# Altium schematic sheet PowerDetection.SchDoc
size A2
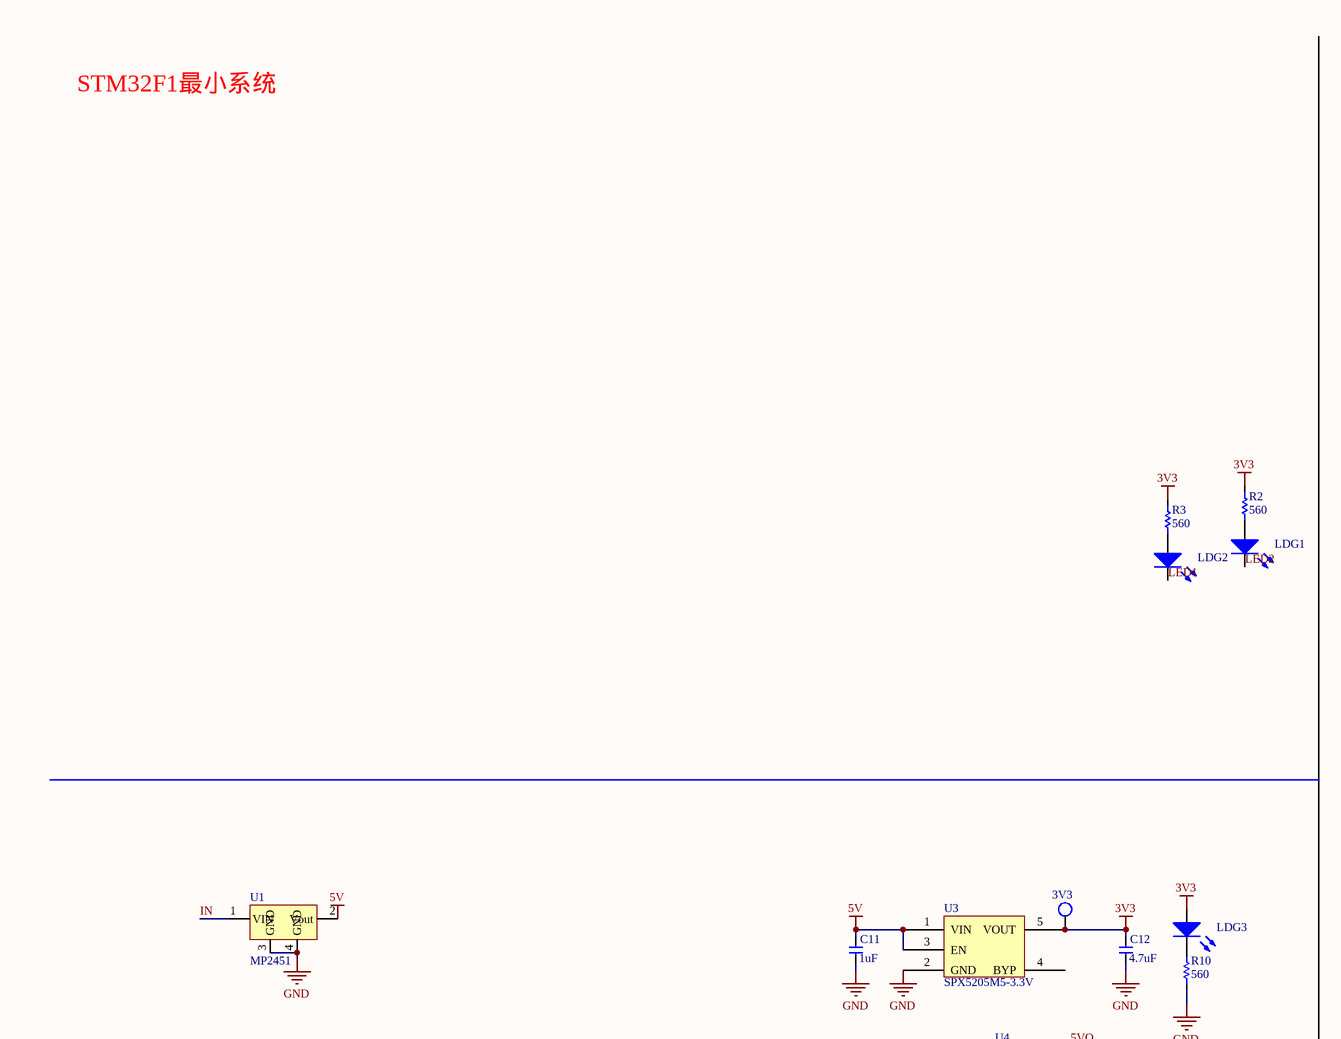
[diagram p0: PowerDetection.SchDoc, top left]
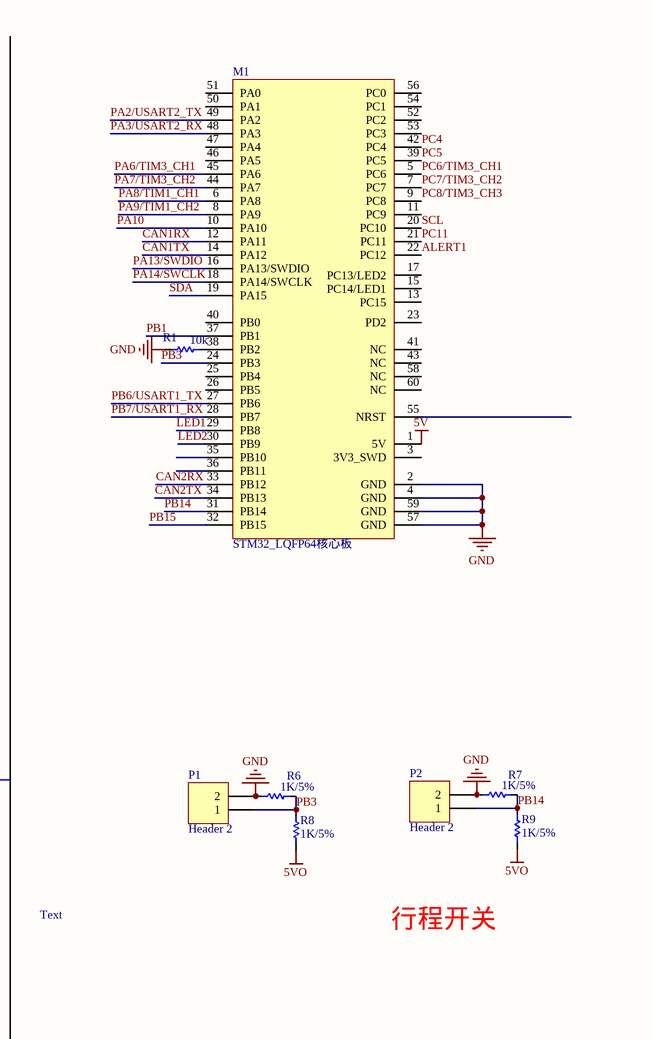
[diagram p1: PowerDetection.SchDoc, top right]
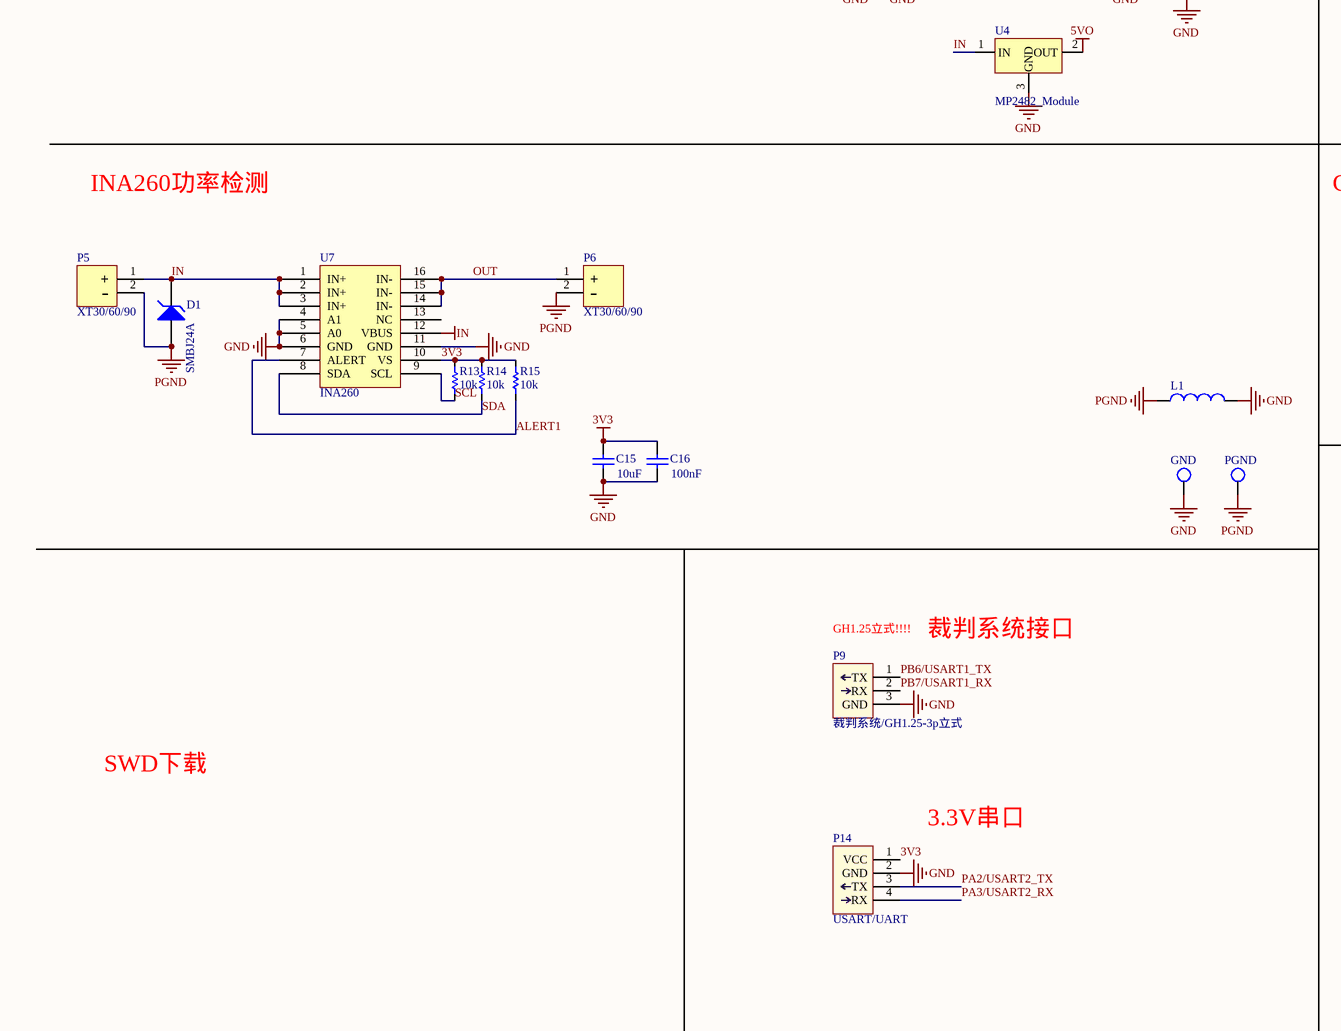
[diagram p2: PowerDetection.SchDoc, bottom left]
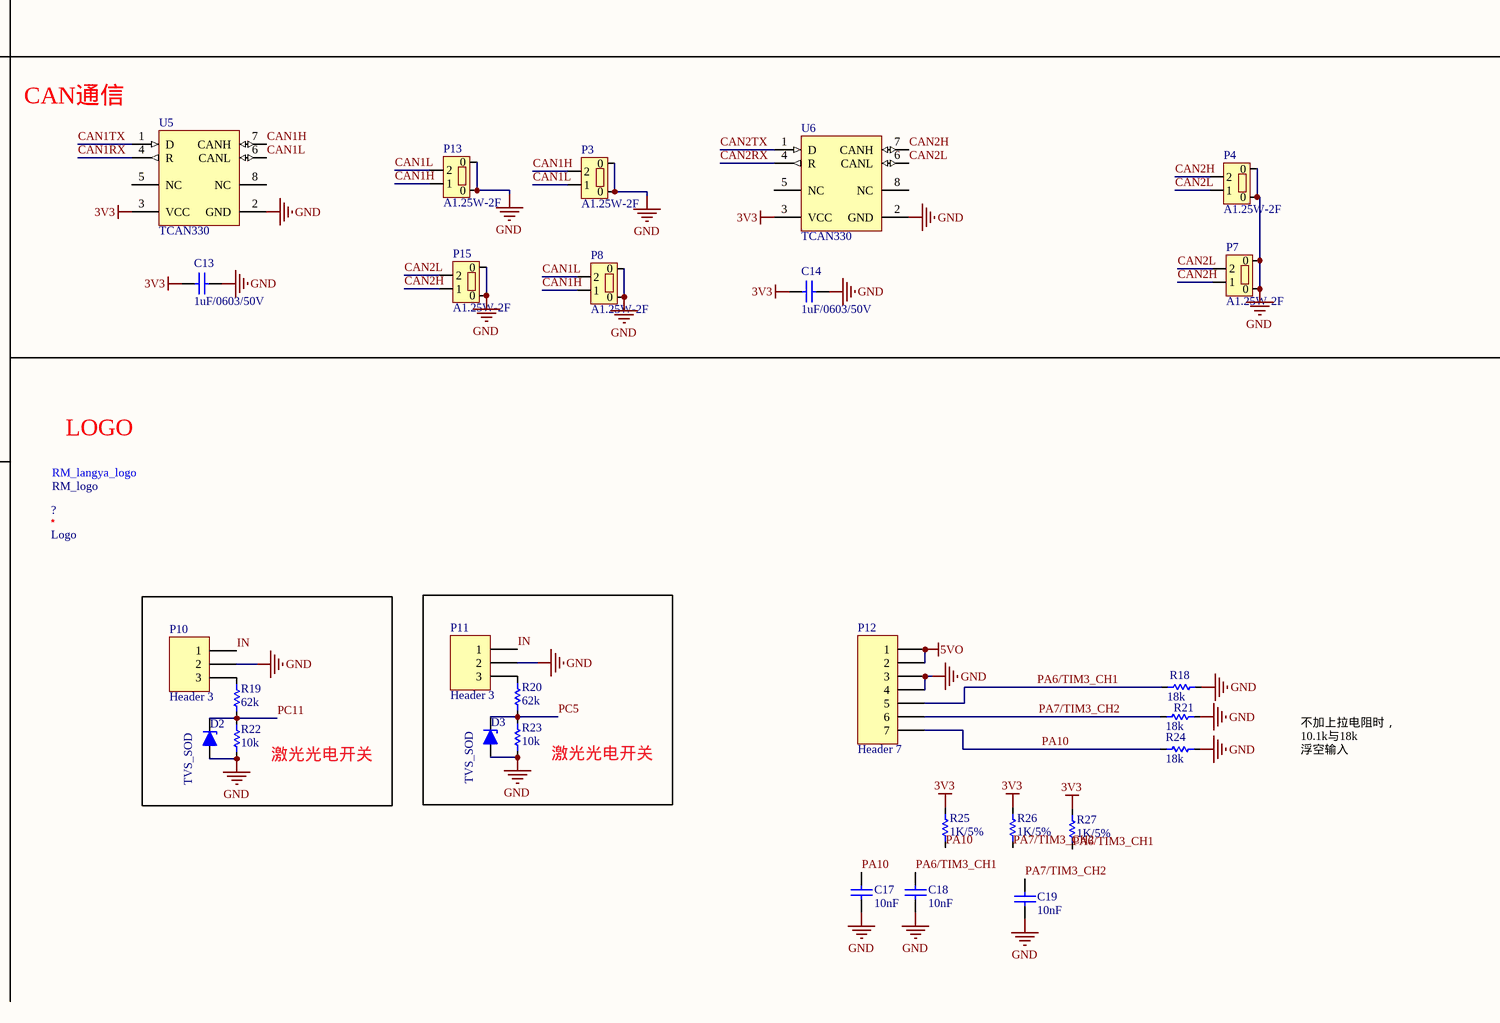
[diagram p3: PowerDetection.SchDoc, bottom right]

## Parts
3V3  3V3  [TP_SMT]  (value not drawn)
?  Logo  [logo_langya - duplicate]
C11  1uF  [0603C]
C12  4.7uF  [0603C]
C13  1uF/0603/50V  [0603C]
C14  1uF/0603/50V  [0603C]
C15  value 10uF  [0603C]  (hidden comment: 100nF)
C16  value 100nF  [0603C]
C17  10nF  [0603C]
C18  10nF  [0603C]
C19  10nF  [0603C]
D1  SMBJ24A  [SMB/DO-214AA]
D2  TVS_SOD  [SOD-323-]
D3  TVS_SOD  [SOD-323-]
GND  PGND  [TP_VIA]  (value not drawn)
L1  10mH/0402  [0603L]  (value not drawn)
LangYa1  RM_logo  [RM_logo 300mil*350]
LDG1  LED_RED  [0603LED_G]  (value not drawn)
LDG2  LED_RED  [0603LED_G]  (value not drawn)
LDG3  LED_RED  [0603LED_G]  (value not drawn)
M1  STM32_LQFP64核心板  [STM32_LQFP64核心板]
P1  Header 2  [HY2.00MM 2X1 SMT]
P2  Header 2  [HY2.00MM 2X1 SMT]
P3  A1.25W-2F  [GH1.25_立式]
P4  A1.25W-2F  [GH1.25_立式]
P5  XT30/60/90  [XT30立式]
P6  XT30/60/90  [XT30立式]
P7  A1.25W-2F  [GH1.25_立式]
P8  A1.25W-2F  [GH1.25_立式]
P9  裁判系统/GH1.25-3p立式  [A1254-03AWB]
P10  Header 3  [HY2.00MM 3X1 SMT]
P11  Header 3  [HY2.00MM 3X1 SMT]
P12  Header 7  [A1.25WF-7P]
P13  A1.25W-2F  [GH1.25-2p-卧贴]
P14  USART/UART  [HY2.00MM 4X1 SMT]
P15  A1.25W-2F  [GH1.25-2p-卧贴]
PGND  PGND  [TP_VIA]  (value not drawn)
R1  10k  [0603R]
R2  560  [0603R]
R3  560  [0603R]
R6  1K/5%  [0603R]
R7  1K/5%  [0603R]
R8  1K/5%  [0603R]
R9  1K/5%  [0603R]
R10  560  [0603R]
R13  10k  [0603R]
R14  10k  [0603R]
R15  10k  [0603R]
R18  18k  [0603R]
R19  62k  [0603R]
R20  62k  [0603R]
R21  18k  [0603R]
R22  10k  [0603R]
R23  10k  [0603R]
R24  18k  [0603R]
R25  1K/5%  [0603R]
R26  1K/5%  [0603R]
R27  1K/5%  [0603R]
U1  MP2451  [MP2451_PowerModule_V2]
U3  SPX5205M5-3.3V  [SOT-23-5 L]
U4  MP2482_Module  [MP2482_PowerModule]
U5  TCAN330  [SOT-23-8]
U6  TCAN330  [SOT-23-8]
U7  INA260  [TSSOP-16]

## Blocks framed on the sheet
激光光电开关: D2 P10 R19 R22
激光光电开关: D3 P11 R20 R23

## Nets
3V3: 3V3.1(TP) C12.2 C13.1 C14.1 C15.2 C16.2 LDG3.1 P14.1(VCC) R2.2 R3.2 R13.1 R14.1 R15.1 R25.2 R26.2 R27.2 U3.5(VOUT) U5.3(VCC) U6.3(VCC) U7.10(VS)
5V: C11.2 M1.1(5V) U1.2(Vout) U3.1(VIN) U3.3(EN)
5VO: P12.1 P12.2 R8.2 R9.2 U4.2(OUT)
GND: C11.1 C12.1 C13.2 C14.2 C15.1 C16.1 C17.1 C18.1 C19.1 D2.1 D3.1 GND.1(TP) L1.2 M1.2(GND) M1.4(GND) M1.57(GND) M1.59(GND) P1.2 P2.2 P3.0 P4.0 P7.0 P8.0 P9.3(GND) P10.2 P11.2 P12.3 P12.4 P13.0 P14.2(GND) P15.0 R1.2 R6.1 R7.1 R10.1 R18.2 R21.1 R22.1 R23.1 R24.1 U1.3(GND) U1.4(GND) U3.2(GND) U4.3(GND) U5.2(GND) U6.2(GND) U7.4(A1) U7.5(A0) U7.6(GND) U7.11(GND)
IN: D1.2(K) P5.1(+) P10.1 P11.1 U1.1(VIN) U4.1(IN) U7.1(IN+) U7.2(IN+) U7.3(IN+) U7.12(VBUS)
PGND: D1.1(A) L1.1 P5.2(-) P6.2(-) PGND.1(TP)
ALERT1: M1.22(PC12) R15.2 U7.7(ALERT)
CAN1H: P3.2 P8.1 P13.1 U5.7(CANH)
CAN1L: P3.1 P8.2 P13.2 U5.6(CANL)
CAN1RX: M1.12(PA11) U5.4(R)
CAN1TX: M1.14(PA12) U5.1(D)
CAN2H: P4.2 P7.1 P15.1 U6.7(CANH)
CAN2L: P4.1 P7.2 P15.2 U6.6(CANL)
CAN2RX: M1.33(PB12) U6.4(R)
CAN2TX: M1.34(PB13) U6.1(D)
LED1: LDG2.2 M1.29(PB8)
LED2: LDG1.2 M1.30(PB9)
OUT: P6.1(+) U7.14(IN-) U7.15(IN-) U7.16(IN-)
PA2/USART2_TX: M1.49(PA2) P14.3(TX)
PA3/USART2_RX: M1.48(PA3) P14.4(RX)
PA6/TIM3_CH1: C18.2 M1.45(PA6) P12.5 R18.1 R27.1
PA7/TIM3_CH2: C19.2 M1.44(PA7) P12.6 R21.2 R26.1
PA8/TIM1_CH1: M1.6(PA8)
PA9/TIM1_CH2: M1.8(PA9)
PA10: C17.2 M1.10(PA10) P12.7 R24.2 R25.1
PA13/SWDIO: M1.16(PA13/SWDIO)
PA14/SWCLK: M1.18(PA14/SWCLK)
PB1: M1.37(PB1)
PB3: M1.24(PB3) P1.1 R6.2 R8.1
PB6/USART1_TX: M1.27(PB6) P9.1(TX)
PB7/USART1_RX: M1.28(PB7) P9.2(RX)
PB14: M1.31(PB14) P2.1 R7.2 R9.1
PB15: M1.32(PB15)
PC4: M1.42(PC4)
PC5: D3.2 M1.39(PC5) R20.1 R23.2
PC6/TIM3_CH1: M1.5(PC6)
PC7/TIM3_CH2: M1.7(PC7)
PC8/TIM3_CH3: M1.9(PC8)
PC11: D2.2 M1.21(PC11) R19.1 R22.2
SCL: M1.20(PC10) R13.2 U7.9(SCL)
SDA: M1.19(PA15) R14.2 U7.8(SDA)
NetLDG1_1: LDG1.1 R2.1
NetLDG2_1: LDG2.1 R3.1
NetLDG3_2: LDG3.2 R10.2
NetM1_38: M1.38(PB2) R1.1
NetP10_3: P10.3 R19.2
NetP11_3: P11.3 R20.2

Not connected (* = marked no-connect by the designer): M1 3(3V3_SWD) 11(PC9) 13(PC15) 15(PC14/LED1) 17(PC13/LED2) 23(PD2) 25(PB4) 26(PB5) 35(PB10) 36(PB11) 40(PB0) 41(NC) 43(NC) 46(PA5) 47(PA4) 50(PA1) 51(PA0) 52(PC2) 53(PC3) 54(PC1) 55(NRST) 56(PC0) 58(NC) 60(NC); U3 4(BYP); U5 5(NC) 8(NC); U6 5(NC) 8(NC); U7 13(NC)

## Notes on the sheet
- STM32F1最小系统
- Text
- 行程开关
- INA260功率检测
- CAN通信
- (near LangYa1) LOGO
- (near P9) GH1.25立式!!!!
- 裁判系统接口
- SWD下载
- 3.3V串口
- 不加上拉电阻时，10.1k与18k
  浮空输入
- (in symbol RM_logo) RM_langya_logo

## Library data of the parts
3V3 GND PGND = TP
C11 C12 = Cap: Value: 100nF
C13 C14 C17-C19 = Cap: Capacitor; Value: 100pF; Published: 8-Jun-2000; LatestRevisionDate: 17-Jul-2002; LatestRevisionNote: Re-released for DXP Platform.; PackageReference: RAD-0.3; Publisher: Altium Limited; PackageDescription: Radial Cap, Thru-Hole; 2 Leads; 0.3 in Pin Spacing
C15 C16 = Cap: Capacitor; Published: 8-Jun-2000; LatestRevisionDate: 17-Jul-2002; LatestRevisionNote: Re-released for DXP Platform.; PackageReference: RAD-0.3; Publisher: Altium Limited; PackageDescription: Radial Cap, Thru-Hole; 2 Leads; 0.3 in Pin Spacing
D1 = D Zener: Zener Diode; Published: 8-Jun-2000; LatestRevisionDate: 17-Jul-2002; LatestRevisionNote: Re-released for DXP Platform.; PackageReference: DIODE-0.7; Publisher: Altium Limited; PackageDescription: Diode, Thru-Hole; 2 Leads; 0.7 in Pin Spacing
L1 = Inductor: Code_IEC: 1005; Value: 10mH; Published: 8-Jun-2000; LatestRevisionDate: 29-May-2009; LatestRevisionNote: IPC-7351 Footprint Added.; PackageReference: 0402-A; Publisher: Altium Limited; PackageDescription: Chip Inductor; Code_JEITA: 0402
LDG1-LDG3 = LED: Typical RED, GREEN, YELLOW, AMBER GaAs LED; Published: 8-Jun-2000; LatestRevisionDate: 17-Jul-2002; LatestRevisionNote: Re-released for DXP Platform.; PackageVersion: Feb-2002; PackageReference: 3.2X1.6X1.1; Publisher: Altium Limited; PackageDescription: SM LED; 2 Flat Leads
M1 = STM32_LQFP64核心板: STM32_LQFP64核心板 / 兼容F105Rx、F405RGT6、F446Rx / 尺寸23mm x 25mm
P1 P2 = Header 2: Header, 2-Pin; LatestRevisionDate: 17-Jul-2002; LatestRevisionNote: Re-released for DXP Platform.; Publisher: Altium Limited
P3 P4 P7 P8 P13 P15 = GH1.25-2P
P9 = UART_3pin
P10 P11 = Header 3: Header, 3-Pin; LatestRevisionDate: 17-Jul-2002; LatestRevisionNote: Re-released for DXP Platform.; Publisher: Altium Limited
P12 = Header 7: Header, 7-Pin; LatestRevisionDate: 17-Jul-2002; LatestRevisionNote: Re-released for DXP Platform.; Publisher: Altium Limited
P14 = UART_4pin: 带电源串口
R1-R3 R6-R10 R13-R15 R18-R27 = Res1: Resistor; Value: 1K; Published: 8-Jun-2000; LatestRevisionDate: 17-Jul-2002; LatestRevisionNote: Re-released for DXP Platform.; PackageReference: AXIAL-0.3; Publisher: Altium Limited; PackageDescription: Axial Device, Thru-Hole; 2 Leads; 0.3 in Pin Spacing
U1 = MP2451_PowerModule
U5 U6 = SN65HVD232D: 3.3 V CAN Transceiver, 17 mA, -40 to 85 degC, 8-pin SOIC (D), Green (RoHS & no Sb/Br); Manufacturer: Texas Instruments; Drivers Per Package: 1; Transient Pulse Protection(V): -25 to 25; ICC(Max)(mA): 17; Supply Voltage(s)(V): 3.3; Rating: Catalog; DatasheetVersion: SLOS346K; PackageVersion: revM, Jun-2011; PackageReference: D8; PackageDescription: 8-Pin Plastic Small Outline Integrated Circuit, 4.9 x 3.9 mm, Pitch 1.27 mm Pitch; Supplier 1: Digi-Key; Supplier Part Number 1: 296-12282-5-ND; Supplier 2: Farnell; Supplier Part Number 2: 1103107; Supplier 3: Newark; Supplier Part Number 3: 35K4890; Supplier 4: Mouser; Supplier Part Number 4: 595-SN65HVD232D; Eco-Plan: Green (RoHS & no Sb/Br); SubFamily: CAN; Receivers Per Package: 1; Isolated: No; Footprint: SN65HVD232; Mounting Technology: Surface Mount; PartNumber: SN65HVD232D; Code_JEDEC: MS-012AA; ComponentLink1Description: Datasheet; ComponentLink1URL: http://www.ti.com/general/docs/lit/getliterature.tsp?genericPartNumber=SN65HVD232&fileType=pdf
U7 = INA260: Precision Digital Current and Power Monitor With Low-Drift, Precision Integrated Shunt